# EAGLE design new (EAGLE 9.5.2)
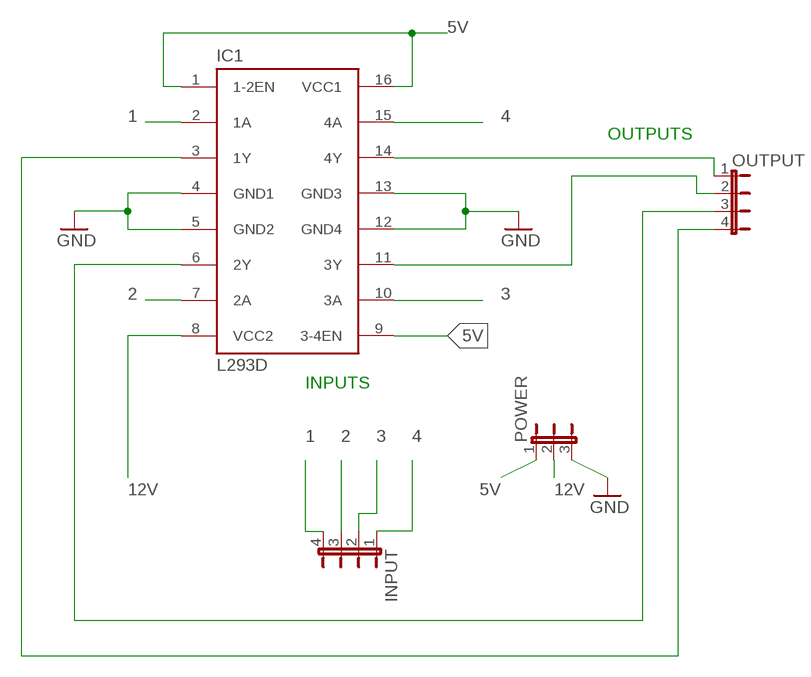
[diagram p0: schematic, sheet 1]

## Parts
IC1  L293D  [DIL16]
INPUT  JP4E  [JP4]
OUTPUT  JP4E  [JP4]
POWER  JP2E  [JP2]

## Nets
1: IC1.2(1A) INPUT.4
2: IC1.7(2A) INPUT.3
3: IC1.10(3A) INPUT.2
4: IC1.15(4A) INPUT.1
5V: IC1.1(1-2EN) IC1.9(3-4EN) IC1.16(VCC1) POWER.1
12V: IC1.8(VCC2) POWER.2
GND: IC1.4(GND1) IC1.5(GND2) IC1.12(GND4) IC1.13(GND3) POWER.3
N$6: IC1.14(4Y) OUTPUT.1
N$8: IC1.11(3Y) OUTPUT.2
N$9: IC1.3(1Y) OUTPUT.4
N$10: IC1.6(2Y) OUTPUT.3

## Notes on the sheet
- OUTPUTS
- INPUTS

## Library data of the parts
IC1 = st-microelectronics:L293D: PUSH-PULL 4 CHANNEL DRIVER; MPN: L293D; OC_FARNELL: 9589619; OC_NEWARK: 56P8249
INPUT OUTPUT = jumper:JP4E: JUMPER
POWER = jumper:JP2E: JUMPER

## Board
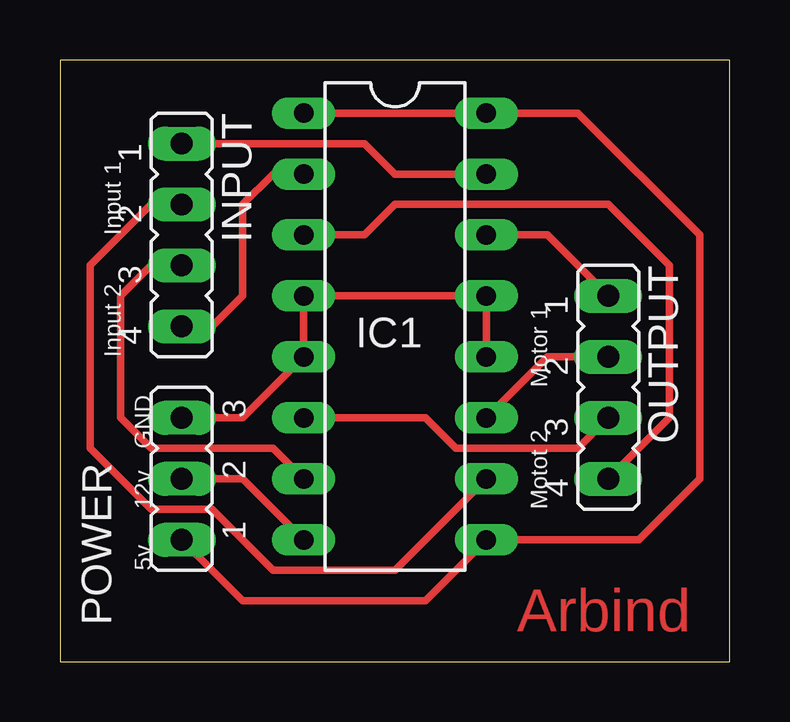
[diagram p1: board, top side]

Size 27.92 x 25.07 mm. Coordinates in mm from the lower left corner, seen from the top.
Outline: 0,0 27.92,0 27.92,25.07 0,25.07 0,0
Copper layers (1*16): Top 0.035mm / dielectric 1.5mm / Bottom 0.035mm
Design rules "default": minimum track width 6mil, minimum drill 0.35mm, track to track 6mil, track to pad 6mil, pad to pad 6mil, via to via 6mil, smd to smd 6mil, copper to edge 40mil, drill to drill 6mil, minimum pad ring 10mil, minimum via ring 8mil, stop-mask expansion 4mil, vias tented up to drill 0mil, thermal gap 10mil

### Footprints (pad centres in the part's own frame; a part is rotated, then mirrored left to right if it is on the bottom)
DIL16 = drill 0.813 long: 1 -8.89,-3.81; 2 -6.35,-3.81; 3 -3.81,-3.81; 4 -1.27,-3.81; 5 1.27,-3.81; 6 3.81,-3.81; 7 6.35,-3.81; 8 8.89,-3.81; 9 8.89,3.81; 10 6.35,3.81; 11 3.81,3.81; 12 1.27,3.81; 13 -1.27,3.81; 14 -3.81,3.81; 15 -6.35,3.81; 16 -8.89,3.81
JP4 = drill 0.914 long: 1 -3.81,0; 2 -1.27,0; 3 1.27,0; 4 3.81,0
JP2 = drill 0.914 long: 1 -2.54,0; 2 0,0; 3 2.54,0

### Placement (x,y rotation side)
IC1  13.97,13.97 270 top
INPUT  5.08,17.78 270 top
OUTPUT  22.86,11.43 270 top
POWER  5.08,7.62 90 top

### Tracks (layer width: path | path; a pad name or v marks a point on that pad's centre or on a via)
1
  Top 0.305: INPUT.4 6.35,13.97 7.62,15.24 7.62,19.05 8.89,20.32 IC1.2
2
  Top 0.305: INPUT.3 3.81,16.51 2.54,15.24 2.54,10.16 3.81,8.89 8.89,8.89 IC1.7
3
  Top 0.305: INPUT.2 3.81,19.05 1.27,16.51 1.27,8.89 3.81,6.35 6.35,6.35 8.89,3.81 13.97,3.81 IC1.10
4
  Top 0.305: INPUT.1 12.7,21.59 13.97,20.32 IC1.15
5V
  Top 0.305: IC1.1 IC1.16 20.32,22.86 21.59,22.86 26.67,17.78 26.67,16.51 26.67,7.62 24.13,5.08 IC1.9 15.24,2.54 7.62,2.54 POWER.1
12V
  Top 0.305: IC1.8 7.62,7.62 POWER.2
GND
  Top 0.305: IC1.12 IC1.13 IC1.4 IC1.5 7.62,10.16 POWER.3
N$6
  Top 0.305: IC1.14 20.32,17.78 OUTPUT.1
N$8
  Top 0.305: IC1.11 20.32,12.7 OUTPUT.2
N$9
  Top 0.305: IC1.3 12.7,17.78 13.97,19.05 22.86,19.05 25.4,16.51 25.4,10.16 OUTPUT.4
N$10
  Top 0.305: IC1.6 15.24,10.16 16.51,8.89 21.59,8.89 OUTPUT.3

### Text on the board
Top: Arbind
tPlace: Input 1 | Input 2 | Motor 1 | GND | 12v | Motot 2 | 5v